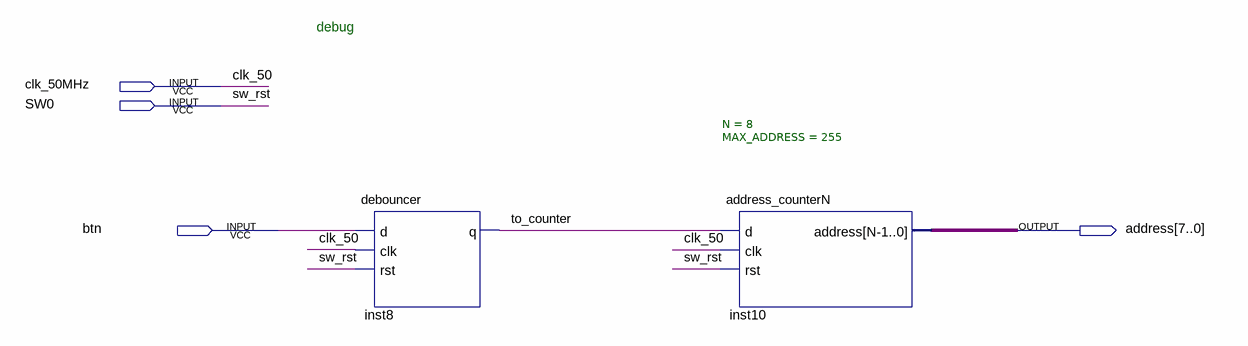
[diagram p0: schematic sheet]
// Quartus schematic debug.bdf as structural Verilog: 2 symbols, 4 pins
module debug (
  input  clk_50MHz,
  input  SW0,
  input  btn,
  output [7:0] address
);

  wire to_counter;

  debouncer inst8 (.d(btn), .clk(clk_50MHz), .rst(SW0), .q(to_counter));
  address_counterN #(.N(8), .MAX_ADDRESS(255)) inst10 (.d(to_counter), .clk(clk_50MHz), .rst(SW0), .address(address));

  // Other names for the same wires on the sheet: clk_50 = clk_50MHz; sw_rst = SW0

  // Notes on the sheet:
  //   debug
endmodule
